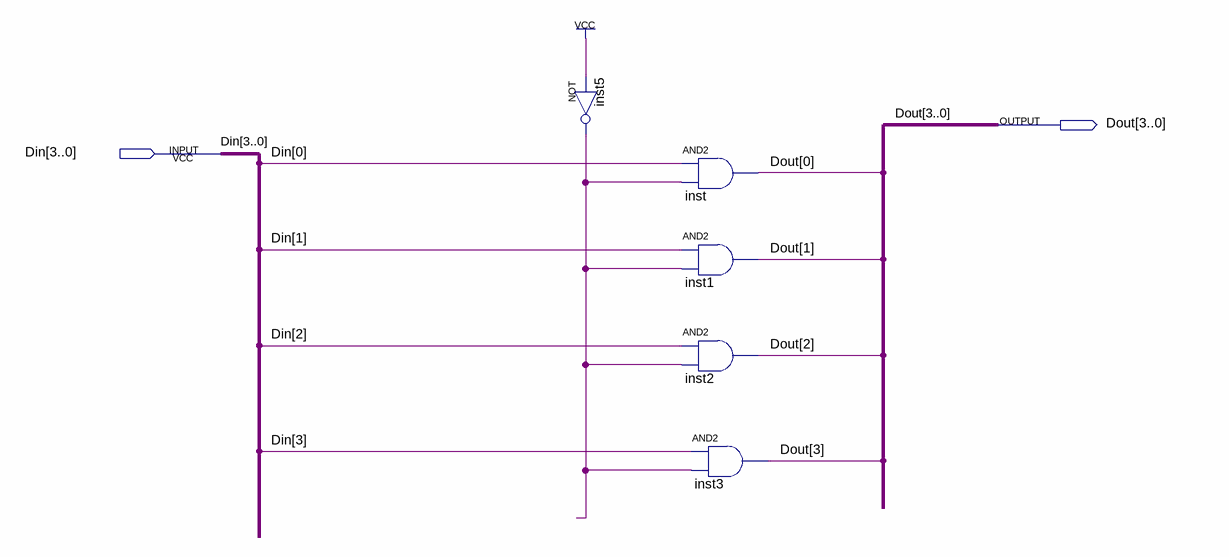
[diagram p0: schematic sheet]
// Quartus schematic changeToZero.bdf as structural Verilog: 5 symbols, 2 pins
module changeToZero (
  input  [3:0] Din,
  output [3:0] Dout
);

  wire inst5_out;

  not inst5 (inst5_out, 1'b1);
  and inst (Dout[0], Din[0], inst5_out);
  and inst1 (Dout[1], Din[1], inst5_out);
  and inst2 (Dout[2], Din[2], inst5_out);
  and inst3 (Dout[3], Din[3], inst5_out);
endmodule
